# Altium schematic sheet isoSPI_Interface.SchDoc: BMS Current Sense isoSPI Interface
size Letter; DocumentNumber: 3; SheetNumber: 3; SheetTotal: 3; Website: www.uwmidsun.com
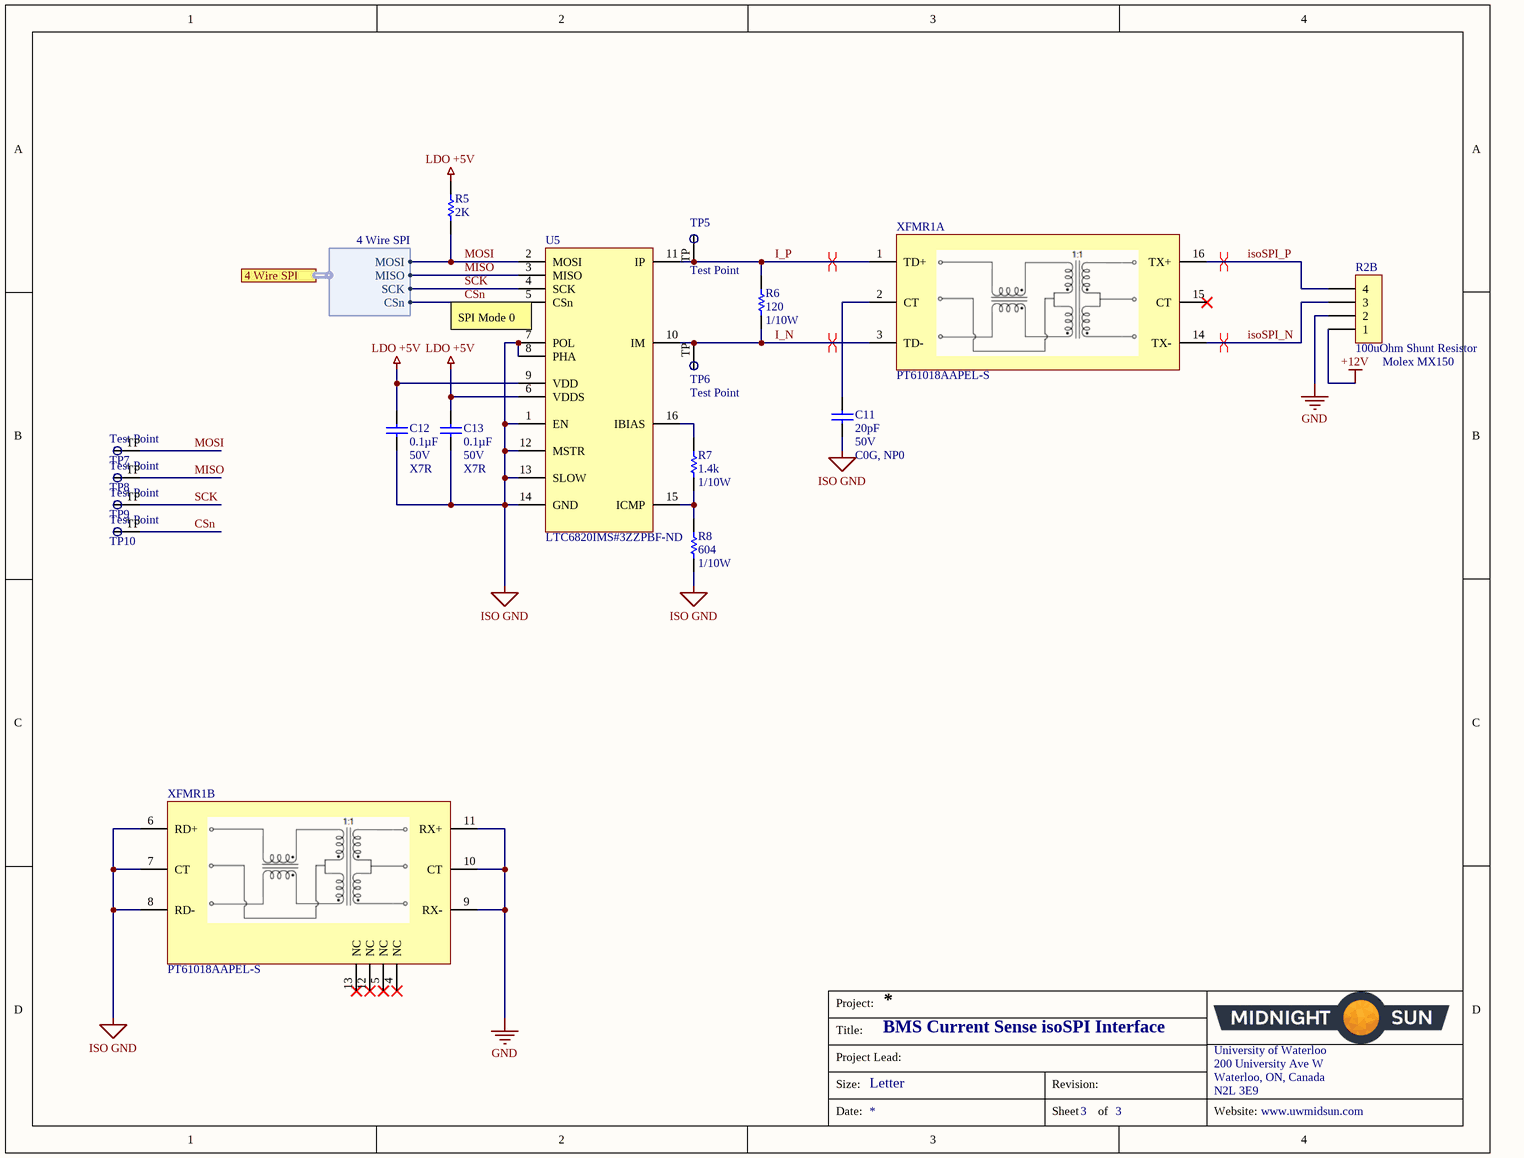
[diagram p0: isoSPI_Interface.SchDoc]

## Parts
C11  Capacitance: 20pF  Voltage: 50V  Temperature Coefficient: C0G, NP0  [CAP, 0603]  (hidden comment: CAP CER 20PF 50V ±5% C0G/NP0 0603)
C12  Capacitance: 0.1µF  Voltage: 50V  Temperature Coefficient: X7R  [CAP, 0603]  (hidden comment: CAP CER 0.1UF 50V 10% X7R 0603)
C13  Capacitance: 0.1µF  Voltage: 50V  Temperature Coefficient: X7R  [CAP, 0603]  (hidden comment: CAP CER 0.1UF 50V 10% X7R 0603)
R2  100uOhm Shunt Resistor  [RES SHUNT 100UOHM 60MM]  (part B of 2)
R5  2K  [RES, 0603]
R6  Resistance: 120  Power: 1/10W  [RES, 0603]  (hidden comment: RES 120 OHM 1% 1/10W 0603)
R7  Resistance: 1.4k  Power: 1/10W  [RES, 0603]  (hidden comment: RES 1.4k OHM 1% 1/10W 0603)
R8  Resistance: 604  Power: 1/10W  [RES, 0603]  (hidden comment: RES 604 OHM 1% 1/10W 0603)
TP5  Test Point  [Test Point]  (no BOM)
TP6  Test Point  [Test Point]  (no BOM)
TP7  Test Point  [Test Point]  (no BOM)
TP8  Test Point  [Test Point]  (no BOM)
TP9  Test Point  [Test Point]  (no BOM)
TP10  Test Point  [Test Point]  (no BOM)
U5  Supplier Part Number 1: LTC6820IMS#3ZZPBF-ND  [IC isoSPI Interface LTC6820 MSOP]  (hidden comment: IC ISOSPI COMM INTERFACE LTC6820IMS#3ZZPBF)
XFMR1  MFG_PN: PT61018AAPEL-S  [IC, PULSE XFMR 1CT:1CT 350UH SMD]  (hidden comment: IC PULSE XFMR 1CT:1CT 350UH SMD)  (parts A,B of 2)

## Ports
4 Wire SPI (harness 4 Wire SPI)

## Harnesses
4 Wire SPI: MOSI, MISO, SCK, CSn

## Nets
+12V: R2.1
GND: R2.2 XFMR1.9(RX-) XFMR1.10(CT) XFMR1.11(RX+)
ISO GND: C11.2 C12.2 C13.2 R8.2 U5.1(EN) U5.7(POL) U5.8(PHA) U5.12(MSTR) U5.13(SLOW) U5.14(GND) XFMR1.6(RD+) XFMR1.7(CT) XFMR1.8(RD-)
LDO +5V: C12.1 C13.1 R5.1 U5.6(VDDS) U5.9(VDD)
CSn: TP10.TP U5.5(CSn) ; port 4 Wire SPI.CSn
I_N: R6.2 TP6.TP U5.10(IM) XFMR1.3(TD-)
I_P: R6.1 TP5.TP U5.11(IP) XFMR1.1(TD+)
isoSPI_N: R2.3 XFMR1.14(TX-)
isoSPI_P: R2.4 XFMR1.16(TX+)
MISO: TP8.TP U5.3(MISO) ; port 4 Wire SPI.MISO
MOSI: R5.2 TP7.TP U5.2(MOSI) ; port 4 Wire SPI.MOSI
SCK: TP9.TP U5.4(SCK) ; port 4 Wire SPI.SCK
NetC11_1: C11.1 XFMR1.2(CT)
NetR7_1: R7.1 U5.16(IBIAS)
NetR7_2: R7.2 R8.1 U5.15(ICMP)

Not connected (* = marked no-connect by the designer): XFMR1 4(NC)* 5(NC)* 12(NC)* 13(NC)* 15(CT)*

## Layout directives
differential pair: I_N, I_P, isoSPI_N, isoSPI_P

## Notes on the sheet
- (near U5) SPI Mode 0
- (near R2) Molex MX150
- Project:
- Title:
- Size:
- Project Lead:
- Letter
- Revision:
- University of Waterloo
- 200 University Ave W
- Waterloo, ON, Canada
- N2L 3E9
- Date:
- Sheet
- of
- Website:

## Library data of the parts
C11 = CAP CER 20PF 50V ±5% C0G/NP0 0603: 20pF ±5% 50V Ceramic Capacitor C0G, NP0 0603 (1608 Metric); Manufacturer 1: Murata Electronics North America; Manufacturer Part Number 1: GRM1885C1H200JA01D; Supplier 1: Digi-Key; Supplier Part Number 1: 490-1410-1-ND; Packaging: Cut Tape (CT); Part Status: Active; Operating Temperature: -55°C ~ 125°C; Ratings: -; Mounting Type: Surface Mount, MLCC; Package / Case: 0603 (1608 Metric); Size / Dimension: 0.063" L x 0.031" W (1.60mm x 0.80mm); Height - Seated (Max): -; Thickness (Max): 0.035" (0.90mm); Lead Spacing: -; Lead Style: -; ComponentLink1URL: http://www.murata.com/~/media/webrenewal/support/library/catalog/products/capacitor/mlcc/c02e.ashx; ComponentLink1Description: http://www.murata.com/~/media/webrenewal/support/library/catalog/products/capacitor/mlcc/c02e.ashx; Tolerance: ±5%
C12 C13 = CAP CER 0.1UF 50V 10% X7R 0603: 0.10µF ±10% 50V Ceramic Capacitor X7R 0603 (1608 Metric); Manufacturer 1: AVX Corporation; Manufacturer Part Number 1: 06035C104KAT2A; Supplier 1: Digi-Key; Supplier Part Number 1: 478-5052-1-ND; Packaging: Cut Tape (CT); Part Status: Active; Operating Temperature: -55°C ~ 125°C; Ratings: -; Mounting Type: Surface Mount, MLCC; Package / Case: 0603 (1608 Metric); Size / Dimension: 0.063" L x 0.032" W (1.60mm x 0.81mm); Height - Seated (Max): -; Thickness (Max): 0.035" (0.90mm); Lead Spacing: -; Lead Style: -; ComponentLink1URL: http://datasheets.avx.com/X7RDielectric.pdf; ComponentLink1Description: http://datasheets.avx.com/X7RDielectric.pdf; Tolerance: ±10%
R2 = RES SHUNT 100UOHM 5% 36W 60MM: 100 µOhms ±5% 36W Shunt, Battery Specialized Resistor Metal Element ±175ppm/°C Shunt Fixture, 60mm Pitch; Manufacturer 1: Vishay Dale; Manufacturer Part Number 1: WSBM8518L1000JK; Supplier 1: Digi-Key; Supplier Part Number 1: 541-1906-ND; RoHS: RoHS Compliant; Description 1: RES SHUNT 100 UOHM 5% 36W; Category: Resistors; Stock 1: 0; Pricing 1: 1=16.24, 10=14.764, 25=13.2876, 50=11.442, 100=10.5192, 250=9.9656, 500=9.5965, 1000=9.15359 (CAD); Packaging: Bulk; Part Status: Active; Type: Shunt, Battery; Applications: -; Composition: Metal Element; Tolerance: ±5%; Power (Watts): 36W; Temperature Coefficient: ±175ppm/°C; Operating Temperature: -65°C ~ 170°C; Mounting Type: Shunt Fixture, 60mm Pitch; ComponentLink1URL: http://www.vishay.com/docs/31094/wsbm8518.pdf; ComponentLink1Description: http://www.vishay.com/docs/31094/wsbm8518.pdf
R5 = RES 2K OHM 1% 1/10W 0603: 2k Ohm ±1% 0.1W, 1/10W Chip Resistor 0603 (1608 Metric) Moisture Resistant Thick Film; Manufacturer: Yageo; Manufacturer Part Number: RC0603FR-072KL; Temperature Coefficient: ±100ppm/°C; Supplier 1: Digi-Key; RoHS: RoHS Compliant; Category: Resistors; Stock 1: 1750701; Pricing 1: 1=0.15, 10=0.023, 100=0.0093, 1000=0.00415, 2500=0.0036 (CAD); Packaging: Cut Tape (CT); Part Status: Active; Resistance (Ohms): 2k; Tolerance: ±1%; Power (Watts): 0.1W, 1/10W; Composition: Thick Film; Features: Moisture Resistant; Operating Temperature: -55°C ~ 155°C; Package / Case: 0603 (1608 Metric); Supplier Device Package: 0603; Size / Dimension: 0.063" L x 0.031" W (1.60mm x 0.80mm); Height - Seated (Max): 0.022" (0.55mm); Failure Rate: -; ComponentLink1URL: http://www.yageo.com/documents/recent/PYu-RC_Group_51_RoHS_L_7.pdf; ComponentLink1Description: http://www.yageo.com/documents/recent/PYu-RC_Group_51_RoHS_L_7.pdf; Supplier Part Number 1: 311-2.00KHRCT-ND
R6 = RES 120 OHM 1% 1/10W 0603: RES SMD 120 OHM 1% 1/10W 0603; Manufacturer 1: Yageo; Manufacturer Part Number 1: RC0603FR-07120RL; Temperature Coefficient: ±100ppm/°C; Supplier 1: Digi-Key; Supplier Part Number 1: 311-120HRCT-ND; Packaging: Cut Tape (CT); Part Status: Active; Composition: Thick Film; Operating Temperature: -55°C ~ 155°C; Package / Case: 0603 (1608 Metric); Supplier Device Package: 0603; Size / Dimension: 0.063" L x 0.031" W (1.60mm x 0.80mm); Height - Seated (Max): 0.022" (0.55mm); Failure Rate: -; ComponentLink1URL: http://www.yageo.com/documents/recent/PYu-RC_Group_51_RoHS_L_7.pdf; ComponentLink1Description: http://www.yageo.com/documents/recent/PYu-RC_Group_51_RoHS_L_7.pdf; Tolerance: ±1%
R7 = RES 1.4k OHM 1% 1/10W 0603: RES SMD 1.4K OHM 1% 1/10W 0603; Manufacturer 1: Yageo; Manufacturer Part Number 1: RC0603FR-071K4L; Temperature Coefficient: ±100ppm/°C; Supplier 1: Digi-Key; Supplier Part Number 1: 311-1.40KHRCT-ND; Packaging: Cut Tape (CT); Part Status: Active; Composition: Thick Film; Operating Temperature: -55°C ~ 155°C; Package / Case: 0603 (1608 Metric); Supplier Device Package: 0603; Size / Dimension: 0.063" L x 0.031" W (1.60mm x 0.80mm); Height - Seated (Max): 0.022" (0.55mm); Failure Rate: -; ComponentLink1URL: http://www.yageo.com/documents/recent/PYu-RC_Group_51_RoHS_L_7.pdf; ComponentLink1Description: http://www.yageo.com/documents/recent/PYu-RC_Group_51_RoHS_L_7.pdf; Tolerance: ±1%
R8 = RES 604 OHM 1% 1/10W 0603: RES SMD 604 OHM 1% 1/10W 0603; Manufacturer 1: Yageo; Manufacturer Part Number 1: RC0603FR-07604RL; Temperature Coefficient: ±100ppm/°C; Supplier 1: Digi-Key; Supplier Part Number 1: 311-604HRCT-ND; Packaging: Cut Tape (CT); Part Status: Active; Composition: Thick Film; Operating Temperature: -55°C ~ 155°C; Package / Case: 0603 (1608 Metric); Supplier Device Package: 0603; Size / Dimension: 0.063" L x 0.031" W (1.60mm x 0.80mm); Height - Seated (Max): 0.022" (0.55mm); Failure Rate: -; ComponentLink1URL: http://www.yageo.com/documents/recent/PYu-RC_Group_51_RoHS_L_7.pdf; ComponentLink1Description: http://www.yageo.com/documents/recent/PYu-RC_Group_51_RoHS_L_7.pdf; Tolerance: ±1%
U5 = IC ISOSPI COMM INTERFACE LTC6820IMS#3ZZPBF: IC COMM INTERFACE ISOSPI 16-MSOP; Manufacturer: Linear Technology; Interface: SPI; Voltage - Supply: 2.7 V ~ 5.5 V; Manufacturer Part Number: LTC6820IMS#3ZZPBF; RoHS: RoHS Compliant; Category: Integrated Circuits (ICs); Packaging: Tube; Part Status: Active; Applications: Isolated Communications Interface; Package / Case: 16-Lead Plastic MSOP; Supplier Device Package: 16-Lead Plastic MSOP; Mounting Type: Surface Mount; ComponentLink1URL: http://www.linear.com/docs/42317; ComponentLink1Description: http://www.linear.com/docs/42317; Supplier 1: Digi-Key
XFMR1 = IC PULSE XFMR 1CT:1CT 350UH SMD: PULSE XFMR 1CT:1CT 350UH SMD; Manufacturer: Bourns Inc.; Isolation Voltage: 1.5kVrms; Supplier: Digikey; Supplier_PN: PT61018AAPEL-SCT-ND; Inductance: 350uH; Supplier 1: Digi-Key; Supplier Part Number 1: PT61018AAPEL-SCT-ND